# Altium schematic sheet AudioIN.SchDoc
size A4; SheetNumber: 1; SheetTotal: 6
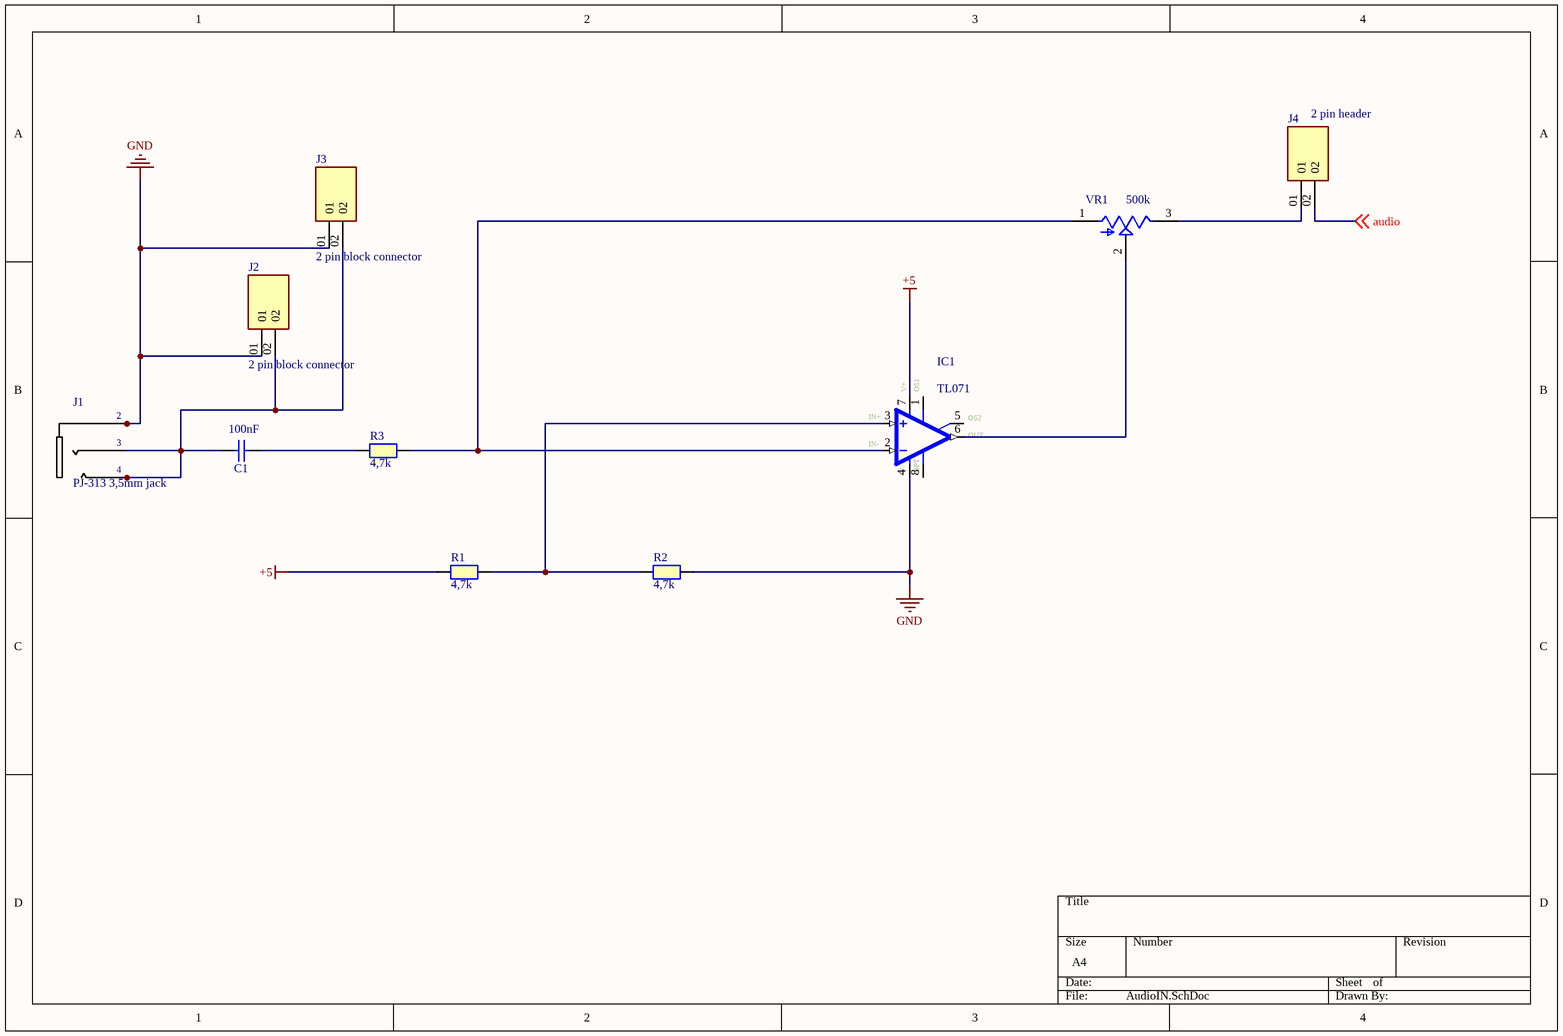
[diagram p0: AudioIN.SchDoc]

## Parts
C1  100nF  [CAPC2012X65N]
IC1  TL071  [DIL08]
J1  PJ-313 3,5mm jack  [*PJ-313_PJ-313(Primary)]
J2  2 pin block connector  [691210910002]
J3  2 pin block connector  [691210910002]
J4  2 pin header  [SAMTEC_HTSW-102-07-TM-S]
R1  4,7k  [RESC2012X50N]
R2  4,7k  [RESC2012X50N]
R3  4,7k  [RESC2012X50N]
VR1  500k  [TRIM_3362P-1-253LF]

## Nets
+5: IC1.7(V+) R1.1
GND: IC1.4(V-) J1.2_1 J1.2_2 J2.01 J3.01 R2.2
audio: J4.02 ; off-sheet audio
NetC1_1: C1.1 J1.3 J1.4_1 J1.4_2 J2.02 J3.02
NetC1_2: C1.2 R3.1
NetIC1_2: IC1.2(-IN) R3.2 VR1.1(CCW)
NetIC1_3: IC1.3(+IN) R1.2 R2.1
NetIC1_6: IC1.6(OUT) VR1.2(WIPER)
NetJ4_01: J4.01 VR1.3(CW)

Not connected (* = marked no-connect by the designer): IC1 1(ON1) 5(ON2) 8(OPT)

## Notes on the sheet
- (in symbol TL071) OS1; IN+; OS2; IN-

## Library data of the parts
C1 = 885012004008: 100nF Keramic cap; Manufacturer: Wurth Elektronik; Match Code: WCAP-CSGP; Case/Size Code: 0201; Capacitance: 22pF; Capacitance Tolerance: +/-5%; Ceramic Type: NP0 Class I; Insulation Resistance: 10GΩ; Q Factor: 840; Rated Voltage (DC): 25V; Technical Reference: NP00201220J025DFCT10000; Manufacturer Part Number: 885012004008; Category: Multilayer Ceramic Chip Capacitors; ComponentLink1Description: Website Link; ComponentLink1URL: https://www.we-online.com/redexpert/article/885012004008?ad; ComponentLink2Description: Datasheet Link; ComponentLink2URL: https://www.we-online.com/redexpert/spec/885012004008?ad; Mount: Surface Mount; Operating Temperature Max: 125°C; Operating Temperature Min: -55°C; Packaging: Tape and Reel; Length: 0.6mm; Width: 0.3mm; Height: 0.3mm
IC1 = TL071: J-FET Amplifier 1 Circuit 8-SO; MF: STMicroelectronics; Price: None; SnapEDA_Link: https://www.snapeda.com/parts/TL071/STMicroelectronics/view-part/1566080/?ref=snap; Availability: Unavailable; Value: *; MP: TL071; Package: SOIC-8 STMicroelectronics
J1 = PJ-313: 3,5cm jack; MP: PJ313; MF: ADC Telecommunications; Package: None; Availability: Not in stock; Check_prices: https://www.snapeda.com/parts/PJ313/ADC+Telecommunications/view-part/?ref=eda; SnapEDA_Link: https://www.snapeda.com/parts/PJ313/ADC+Telecommunications/view-part/?ref=snap; Price: None; Value: *
J2 J3 = 2 pin header: HEADER, 2 CONTACTS, 1 ROW, THROUGH HOLE, 2.54 MM; Connector Systems:Board-to-Board; Pitch Spacing:2.54mm; No. of Rows:1Rows; No. of Contacts:2Contacts; Contact Termination Type:Through Hole; Product Range:HTSW Series; Gender:Header RoHS Compliant: Yes; MP: HTSW10207TMS; MF: Samtec; SnapEDA_Link: https://www.snapeda.com/parts/HTSW10207TMS/Samtec/view-part/?ref=snap; Value: *; Purchase-URL: https://pricing.snapeda.com/search/part/HTSW10207TMS/?ref=eda; Availability: In Stock; Check_prices: https://www.snapeda.com/parts/HTSW10207TMS/Samtec/view-part/?ref=eda; Package: None; Price: None
J4 = 2 pin header: 2 pin header Jumper; MP: HTSW10207TMS; MF: Samtec; SnapEDA_Link: https://www.snapeda.com/parts/HTSW10207TMS/Samtec/view-part/?ref=snap; Value: *; Purchase-URL: https://pricing.snapeda.com/search/part/HTSW10207TMS/?ref=eda; Availability: In Stock; Check_prices: https://www.snapeda.com/parts/HTSW10207TMS/Samtec/view-part/?ref=eda; Package: None; Price: None
R1-R3 = RESISTOR 0805: 4,7k Resistor 0805; Part Number: TNPW080510K0BETA; Manufacturer: Vishay Dale
VR1 = 3362P-1-253LF: 25 kOhms 0.5W, 1/2W PC Pins Through Hole Trimmer Potentiometer Cermet 1 Turn Top Adjustment; MF: Bourns; Check_prices: https://www.snapeda.com/parts/3362P-1-253LF/Bourns/view-part/493663/?ref=eda; SnapEDA_Link: https://www.snapeda.com/parts/3362P-1-253LF/Bourns/view-part/493663/?ref=snap; Availability: Good; Value: *; Purchase-URL: https://pricing.snapeda.com/search/part/3362P-1-253LF/?ref=eda; Price: None; MP: 3362P-1-253LF; Package: 3116 Bourns